# Altium schematic sheet DRV8323SRTAT.SchDoc
size A
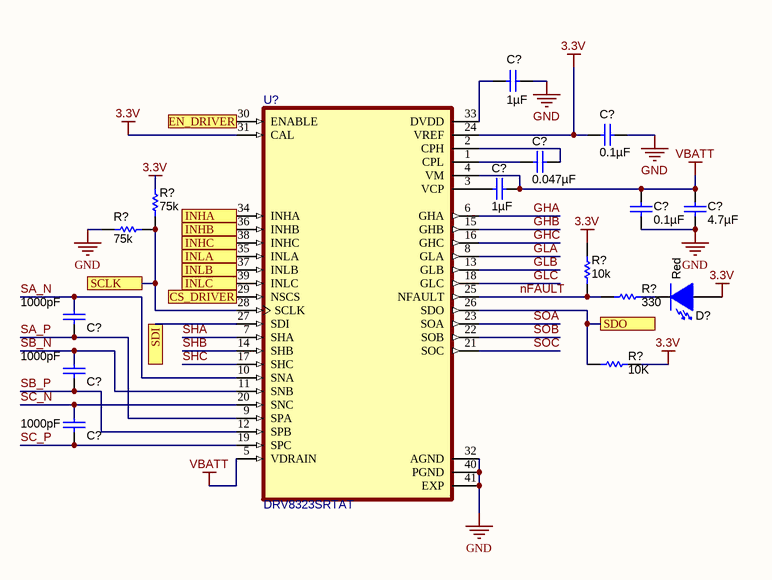
[diagram p0: DRV8323SRTAT.SchDoc]

## Parts
(Parts that share a designator on the sheet are numbered #1, #2 ... from top to bottom, then left to right.)
C?#1  ValueDisplayed: 1µF  [0603L]  (hidden comment: GRM188R70J105KA01D)
C?#2  ValueDisplayed: 0.1µF  [0603L]  (hidden comment: GRM188R70J104KA01D)
C?#3  ValueDisplayed: 0.047µF  [0603L]  (hidden comment: C1608X7S2A473K080AB)
C?#4  ValueDisplayed: 1µF  [0603L]  (hidden comment: 885012206052)
C?#5  ValueDisplayed: 0.1µF  [0603L]  (hidden comment: GRM188R72A104KA35D)
C?#6  ValueDisplayed: 4.7µF  [1210_270L]  (hidden comment: GRM32ER71K475KE14L)
C?#7  ValueDisplayed: 1000pF  [0603L]  (hidden comment: GRM188R71C102KA01D)
C?#8  ValueDisplayed: 1000pF  [0603L]  (hidden comment: GRM188R71C102KA01D)
C?#9  ValueDisplayed: 1000pF  [0603L]  (hidden comment: GRM188R71C102KA01D)
D?  value Red  [LED_LTST-C170]  (hidden comment: LTST-C170KRKT)
R?#1  ValueDisplayed: 75k  [0603L]  (hidden comment: CRCW060375K0JNEA)
R?#2  ValueDisplayed: 75k  [0603L]  (hidden comment: CRCW060375K0JNEA)
R?#3  ValueDisplayed: 10k  [0603L]  (hidden comment: CRCW060310K0JNEA)
R?#4  value 330  [0603L]  (hidden comment: CRCW0603330RJNEA)
R?#5  ValueDisplayed: 10K  [0603L]  (hidden comment: CRCW06031K50JNEA)
U?  DRV8323SRTAT  [QFN50P600X600X80-41N415X415]

## Ports
CS_DRIVER, EN_DRIVER, INHA, INHB, INHC, INLA, INLB, INLC, SCLK, SDI, SDO

## Nets
3.3V: C?#2.1 D?.1(A) R?#1.2 R?#3.2 R?#5.1 U?.24(VREF) U?.31(CAL)
GND: C?#1.1 C?#2.2 C?#5.2 C?#6.2 R?#2.2 U?.32(AGND) U?.40(PGND) U?.41(EXP)
VBATT: C?#4.2 C?#5.1 C?#6.1 U?.4(VM) U?.5(VDRAIN)
CS_DRIVER: U?.29(NSCS) ; port CS_DRIVER
EN_DRIVER: U?.30(ENABLE) ; port EN_DRIVER
GHA: U?.6(GHA)
GHB: U?.15(GHB)
GHC: U?.16(GHC)
GLA: U?.8(GLA)
GLB: U?.13(GLB)
GLC: U?.18(GLC)
INHA: U?.34(INHA) ; port INHA
INHB: U?.36(INHB) ; port INHB
INHC: U?.38(INHC) ; port INHC
INLA: U?.35(INLA) ; port INLA
INLB: U?.37(INLB) ; port INLB
INLC: U?.39(INLC) ; port INLC
nFAULT: R?#3.1 R?#4.1 U?.25(NFAULT)
SA_N: C?#7.1 U?.10(SNA)
SA_P: C?#7.2 U?.9(SPA)
SB_N: C?#8.1 U?.11(SNB)
SB_P: C?#8.2 U?.12(SPB)
SC_N: C?#9.1 U?.20(SNC)
SC_P: C?#9.2 U?.19(SPC)
SCLK: R?#1.1 R?#2.1 U?.28(SCLK) ; port SCLK
SDI: U?.27(SDI) ; port SDI
SDO: R?#5.2 U?.26(SDO) ; port SDO
SHA: U?.7(SHA)
SHB: U?.14(SHB)
SHC: U?.17(SHC)
SOA: U?.23(SOA)
SOB: U?.22(SOB)
SOC: U?.21(SOC)
NetC?#1_2: C?#1.2 U?.33(DVDD)
NetC?#3_1: C?#3.1 U?.2(CPH)
NetC?#3_2: C?#3.2 U?.1(CPL)
NetC?#4_1: C?#4.1 U?.3(VCP)
NetD?_2: D?.2(K) R?#4.2

## Library data of the parts
C?#1 = GRM188R70J105KA01D: CAP, CERM, 1 µF, 6.3 V, +/- 10%, X7R, 0603; Manufacturer: MuRata; Polarized: N; CompType: Capacitor; Value: 1uF; U/M: EA; Cap_F: 0.000001; Tolerance_%: 10; Value1: Unknown; VDC_V: 6.3; Value2: 6.3V; TaMin_C: -55; TaMax_C: 125; Cap_Case: 0603; AEC Category: Q200; SymbolVersion: 2008-07-09; PartNumber: GRM188R70J105KA01D; PackageReference: 0603; RoHS: Y; MountType: SMT; Technology: Ceramic; TempCo: X7R; Published: 2008-06-19; Publisher: Texas Instruments; LatestRevisionDate: 2016-03-19; ComponentLink1Description: Datasheet link; ComponentLink1URL: http://search.murata.co.jp/Ceramy/PnsearchViewAction.do?HnOFG=ON&HnNFG=ON&SEL_CNT=50&sLang=en&sKey=GRM188R70J105KA01D&x=9&y=9&search=startwith; Supplier 1: Digi-Key; Supplier Part Number 1: 490-3898-1-ND; Supplier 2: Mouser; Supplier Part Number 2: 81-GRM188R70J105KA01; Supplier 3: Farnell; Supplier Part Number 3: 1845765; AEC Qualified: ?
C?#2 = GRM188R70J104KA01D: CAP, CERM, 0.1 µF, 6.3 V, +/- 10%, X7R, 0603; Manufacturer: MuRata; Polarized: N; CompType: Capacitor; Value: 0.1uF; U/M: EA; Cap_F: 0.0000001; Tolerance_%: 10; Value1: Unknown; VDC_V: 6.3; Value2: 6.3V; TaMin_C: -55; TaMax_C: 125; Cap_Case: 0603; AEC Category: Q200; SymbolVersion: 2008-07-09; PartNumber: GRM188R70J104KA01D; PackageReference: 0603; RoHS: Y; MountType: SMT; Technology: Ceramic; TempCo: X7R; Published: 2008-06-19; Publisher: Texas Instruments; LatestRevisionDate: 2016-03-19; ComponentLink1Description: Datasheet link; ComponentLink1URL: http://search.murata.co.jp/Ceramy/PnsearchViewAction.do?HnOFG=ON&HnNFG=ON&SEL_CNT=50&sLang=en&sKey=GRM188R70J104KA01D&x=9&y=9&search=startwith; Supplier 1: Digi-Key; Supplier Part Number 1: GRM188R70J104KA01D-ND; Supplier 2: Mouser; Supplier Part Number 2: 81-GRM188R70J104KA1D; AEC Qualified: ?
C?#3 = C1608X7S2A473K080AB: CAP, CERM, 0.047 µF, 100 V, +/- 10%, X7S, 0603; Manufacturer: TDK; Polarized: N; CompType: Capacitor; Value: 0.047uF; U/M: EA; Cap_F: 0.000000047; Tolerance_%: 10; ESR_ohm: 0.089796; Value1: 0.089796 ohm; VDC_V: 100; Value2: 100V; IRMS_A: 0.567484; TaMin_C: -55; TaMax_C: 125; Cap_Case: 0603; AEC Category: Q200; SizeArea_mm2: 1.28; SizeAreaWB_mm2: 4.68; SizeX_mm: 1.6; SizeY_mm: 0.8; SizeZ_mm: 1; SymbolVersion: 2008-07-09; PartNumber: C1608X7S2A473K080AB; PackageReference: 0603; RoHS: Y; MountType: SMT; Technology: Ceramic; TempCo: X7S; Published: 2008-06-19; Publisher: Texas Instruments; LatestRevisionDate: 2016-12-05; ComponentLink1Description: Datasheet link; ComponentLink1URL: https://product.tdk.com/en/search/capacitor/ceramic/mlcc/info?part_no=C1608X7S2A473K080AB; Supplier 1: Digi-Key; Supplier Part Number 1: 445-6032-1-ND; Supplier 2: Mouser; Supplier Part Number 2: 810-C1608X7S2A473K080AB; AEC Qualified: N; AEC Grade: N/A
C?#4 = 885012206052: CAP, CERM, 1 µF, 16 V, +/- 10%, X7R, 0603; Manufacturer: Wurth Elektronik; Polarized: N; CompType: Capacitor; Value: 1uF; U/M: EA; Cap_F: 0.000001; Tolerance_%: 10; Value1: Unknown; VDC_V: 16; Value2: 16V; TaMin_C: -55; TaMax_C: 125; Cap_Case: 0603; AEC Category: Q200; SymbolVersion: 2008-07-09; PartNumber: 885012206052; PackageReference: 0603; RoHS: Y; MountType: SMT; Technology: Ceramic; TempCo: X7R; Published: 2008-06-19; Publisher: Texas Instruments; LatestRevisionDate: 2016-03-19; ComponentLink1Description: Datasheet link; ComponentLink1URL: http://katalog.we-online.de/pbs/datasheet/885012206052.pdf; Supplier 1: Mouser; Supplier Part Number 1: 710-885012206052; AEC Qualified: N; AEC Grade: N/A
C?#5 = GRM188R72A104KA35D: CAP, CERM, 0.1 µF, 100 V, +/- 10%, X7R, 0603; Manufacturer: MuRata; Polarized: N; CompType: Capacitor; Value: 0.1uF; U/M: EA; Cap_F: 0.0000001; Tolerance_%: 10; Value1: Unknown; VDC_V: 100; Value2: 100V; TaMin_C: -55; TaMax_C: 125; Cap_Case: 0603; AEC Category: Q200; SymbolVersion: 2008-07-09; PartNumber: GRM188R72A104KA35D; PackageReference: 0603; RoHS: Y; MountType: SMT; Technology: Ceramic; TempCo: X7R; Published: 2008-06-19; Publisher: Texas Instruments; LatestRevisionDate: 2016-03-19; ComponentLink1Description: Datasheet link; ComponentLink1URL: http://search.murata.co.jp/Ceramy/PnsearchViewAction.do?HnOFG=ON&HnNFG=ON&SEL_CNT=50&sLang=en&sKey=GRM188R72A104KA35D&x=9&y=9&search=startwith; Supplier 1: Digi-Key; Supplier Part Number 1: 490-3285-1-ND; Supplier 2: Mouser; Supplier Part Number 2: 81-GRM188R72A104KA35; Supplier 3: Farnell; Supplier Part Number 3: 1828921; AEC Qualified: ?
C?#6 = GRM32ER71K475KE14L: CAP, CERM, 4.7 µF, 80 V, +/- 10%, X7R, 1210; Manufacturer: MuRata; Polarized: N; CompType: Capacitor; Value: 4.7uF; U/M: EA; Cap_F: 0.0000047; Tolerance_%: 10; Value1: Unknown; VDC_V: 80; Value2: 80V; TaMin_C: -55; TaMax_C: 125; Cap_Case: 1210; AEC Category: Q200; SizeArea_mm2: 8; SizeAreaWB_mm2: 14.7; SizeX_mm: 3.2; SizeY_mm: 2.5; SizeZ_mm: 2.7; SymbolVersion: 2008-07-09; PartNumber: GRM32ER71K475KE14L; PackageReference: 1210; RoHS: Y; MountType: SMT; Technology: Ceramic; TempCo: X7R; Published: 2008-06-19; Publisher: Texas Instruments; LatestRevisionDate: 2016-12-05; ComponentLink1Description: Datasheet link; ComponentLink1URL: http://psearch.en.murata.com/capacitor/product/GRM32ER71K475KE14%23.pdf; Supplier 1: Digi-Key; Supplier Part Number 1: 490-9972-1-ND; Supplier 2: Mouser; Supplier Part Number 2: 81-GRM32ER71K475KE4L; AEC Qualified: N; AEC Grade: N/A
C?#7-C?#9 = GRM188R71C102KA01D: CAP, CERM, 1000pF, 16V, +/-10%, X7R, 0603; Manufacturer: MuRata; Polarized: N; CompType: Capacitor; U/M: EA; Cap_F: 0.000000001; Tolerance_%: 10; Value1: Unknown; VDC_V: 16; TaMin_C: -55; TaMax_C: 125; Cap_Case: 0603; SymbolVersion: 2008-07-09; Value: 1000pF; PartNumber: GRM188R71C102KA01D; PackageReference: 0603; RoHS: Y; Value2: 16V; MountType: SMT; Technology: Ceramic; TempCo: X7R; Published: 2008-06-19; Publisher: Texas Instruments; LatestRevisionDate: 2014-07-08; ComponentLink1Description: Datasheet link; ComponentLink1URL: http://search.murata.co.jp/Ceramy/PnsearchViewAction.do?HnOFG=ON&HnNFG=ON&SEL_CNT=50&sLang=en&sKey=GRM188R71C102KA01D&x=9&y=9&search=startwith; Supplier 1: Digi-Key; Supplier Part Number 1: GRM188R71C102KA01D-ND; Supplier 2: Mouser; Supplier Part Number 2: 81-GRM188R71C102KA1D
D? = LTST-C170KRKT: LED, Red, SMD; Manufacturer: Lite-On; Type: AlInGaP; Vf_V: 2; Value2: 2V; Io_A: 20; Value1: W; U/M: EA; CompType: LED; PartNumber: LTST-C170KRKT; SymbolVersion: 2008-12-08; MountType: SMT; RoHS: Y; PackageReference: LED_0805; Color: red; Published: 2008-07-11; Publisher: Texas Instruments; ComponentLink1URL: http://optoelectronics.liteon.com/en-us/api/DwonloadFileHandler.ashx?txtSpecNo=DS-22-99-0150&txtPartNo=LTST-C170KRKT; ComponentLink1Description: Datasheet link; LatestRevisionDate: 2013-09-07; Supplier 1: Digi-Key; Supplier Part Number 1: 160-1415-1-ND; Supplier 2: Mouser; Supplier Part Number 2: 859-LTST-C170KRKT
R?#1 R?#2 = CRCW060375K0JNEA: RES, 75 k, 5%, 0.1 W, 0603; Manufacturer: Vishay-Dale; CompType: Resistor; Value: 75k; Res_ohm: 75000; Value_Code: 75k0; Tolerance_%: 5; Power_W: 0.1; Value2: 0.1W; VDC_V: 75; TempCo: 200 ppm/C; EIA_Code: E24; U/M: EA; AEC Category: Q200; SymbolVersion: 2009-05-29; PartNumber: CRCW060375K0JNEA; PackageReference: 0603; RoHS: Y; Value1: 5%; MountType: SMT; Technology: Thick Film; Published: 2008-06-26; Publisher: Texas Instruments; LatestRevisionDate: 2016-03-05; ComponentLink1Description: Datasheet link; ComponentLink1URL: http://www.vishay.com/docs/20035/dcrcwe3.pdf; Supplier 1: Digi-Key; Supplier Part Number 1: 541-75KGCT-ND; Supplier 2: Mouser; Supplier Part Number 2: 71-CRCW0603J-75K-E3; Supplier 3: Farnell; Supplier Part Number 3: 1570763; AEC Qualified: ?
R?#3 = CRCW060310K0JNEA: RES, 10 k, 5%, 0.1 W, 0603; Manufacturer: Vishay-Dale; CompType: Resistor; Value: 10k; Res_ohm: 10000; Value_Code: 10k0; Tolerance_%: 5; Power_W: 0.1; Value2: 0.1W; VDC_V: 75; TempCo: 200 ppm/C; EIA_Code: E24; U/M: EA; AEC Category: Q200; SymbolVersion: 2009-05-29; PartNumber: CRCW060310K0JNEA; PackageReference: 0603; RoHS: Y; Value1: 5%; MountType: SMT; Technology: Thick Film; Published: 2008-06-26; Publisher: Texas Instruments; LatestRevisionDate: 2016-03-05; ComponentLink1Description: Datasheet link; ComponentLink1URL: http://www.vishay.com/docs/20035/dcrcwe3.pdf; Supplier 1: Digi-Key; Supplier Part Number 1: 541-10KGCT-ND; Supplier 2: Mouser; Supplier Part Number 2: 71-CRCW0603J-10K-E3; Supplier 3: Farnell; Supplier Part Number 3: 1469749; AEC Qualified: ?
R?#4 = CRCW0603330RJNEA: RES, 330 ohm, 5%, 0.1W, 0603; Manufacturer: Vishay-Dale; CompType: Resistor; Value_Code: 330R; Tolerance_%: 5; Power_W: 0.1; VDC_V: 75; TempCo: 200 ppm/C; EIA_Code: E24; U/M: EA; SymbolVersion: 2009-05-29; PartNumber: CRCW0603330RJNEA; PackageReference: 0603; RoHS: Y; Res_ohm: 330; Value1: 5%; Value2: 0.1W; MountType: SMT; Technology: Thick Film; Published: 2008-06-26; Publisher: Texas Instruments; LatestRevisionDate: 2013-10-22; ComponentLink1Description: Datasheet link; ComponentLink1URL: http://www.vishay.com/docs/20035/dcrcwe3.pdf; Supplier 1: Digi-Key; Supplier Part Number 1: 541-330GCT-ND; Supplier 2: Mouser; Supplier Part Number 2: 71-CRCW0603J-330-E3; Supplier 3: Farnell; Supplier Part Number 3: 1692522
R?#5 = CRCW06031K50JNEA: RES, 1.5 k, 5%, 0.1 W, 0603; Manufacturer: Vishay-Dale; CompType: Resistor; Value: 1.5k; Res_ohm: 1500; Value_Code: 1k50; Tolerance_%: 5; Power_W: 0.1; Value2: 0.1W; VDC_V: 75; TempCo: 200 ppm/C; EIA_Code: E24; U/M: EA; AEC Category: Q200; SymbolVersion: 2009-05-29; PartNumber: CRCW06031K50JNEA; PackageReference: 0603; RoHS: Y; Value1: 5%; MountType: SMT; Technology: Thick Film; Published: 2008-06-26; Publisher: Texas Instruments; LatestRevisionDate: 2016-03-05; ComponentLink1Description: Datasheet link; ComponentLink1URL: http://www.vishay.com/docs/20035/dcrcwe3.pdf; Supplier 1: Digi-Key; Supplier Part Number 1: 541-1.5KGCT-ND; Supplier 2: Mouser; Supplier Part Number 2: 71-CRCW0603J-1.5K-E3; Supplier 3: Farnell; Supplier Part Number 3: 1531366; AEC Qualified: ?
U? = DRV8323SRTAT: Multiphase Motor Driver Power MOSFET SPI 40-WQFN _6x6_; MF: Texas Instruments; SnapEDA_Link: https://www.snapeda.com/parts/DRV8323SRTAT/Texas%20Instruments/view-part/1675025/?ref=snap; Price: None; MP: DRV8323SRTAT; Package: WQFN-40 Texas Instruments; Value: *; Availability: Unavailable